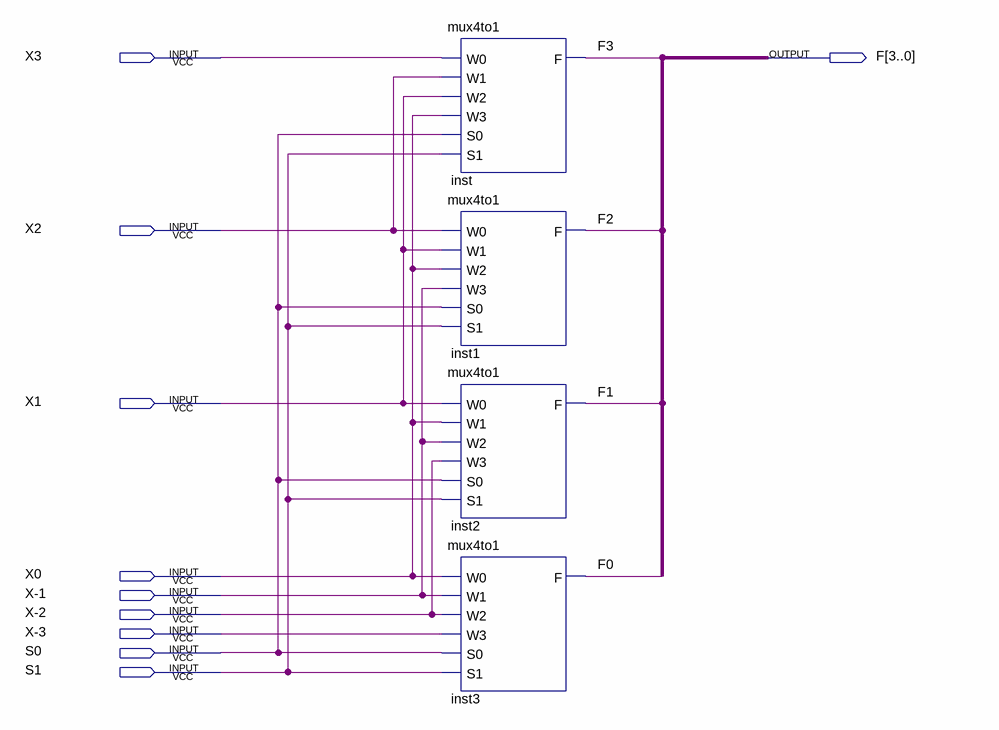
[diagram p0: schematic sheet]
// Quartus schematic lab08step3.bdf as structural Verilog: 4 symbols, 10 pins
module lab08step3 (
  input  X3,
  input  X2,
  input  X1,
  input  X0,
  input  \X-1 ,
  input  \X-2 ,
  input  \X-3 ,
  input  S0,
  input  S1,
  output [3:0] F
);

  mux4to1 inst (.W0(X3), .W1(X2), .W2(X1), .W3(X0), .S0(S0), .S1(S1), .F(F[3]));
  mux4to1 inst1 (.W0(X2), .W1(X1), .W2(X0), .W3(\X-1 ), .S0(S0), .S1(S1), .F(F[2]));
  mux4to1 inst2 (.W0(X1), .W1(X0), .W2(\X-1 ), .W3(\X-2 ), .S0(S0), .S1(S1), .F(F[1]));
  mux4to1 inst3 (.W0(X0), .W1(\X-1 ), .W2(\X-2 ), .W3(\X-3 ), .S0(S0), .S1(S1), .F(F[0]));
endmodule
